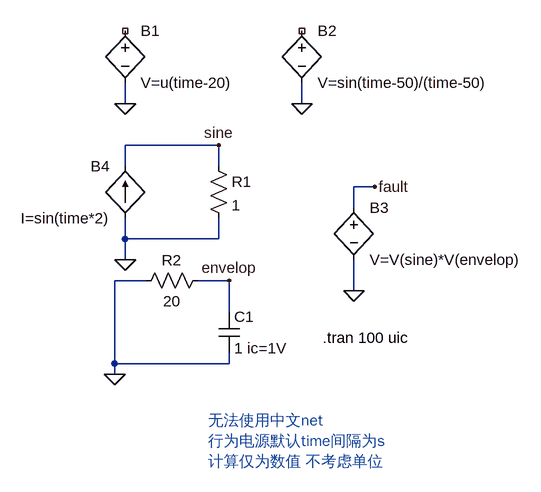
[diagram p0: schematic Draft6.asc]
Draft6.asc, the LTspice schematic file:
Version 4.1
SHEET 1 880 688
WIRE 64 128 64 96
WIRE 336 128 336 96
WIRE 208 192 64 192
WIRE 64 224 64 192
WIRE 208 224 208 192
WIRE 448 256 416 256
WIRE 416 288 416 256
WIRE 64 336 64 304
WIRE 208 336 208 304
WIRE 208 336 64 336
WIRE 64 368 64 336
WIRE 96 400 48 400
WIRE 224 400 176 400
WIRE 416 416 416 368
WIRE 224 448 224 400
WIRE 48 528 48 400
WIRE 224 528 224 512
WIRE 224 528 48 528
WIRE 48 544 48 528
FLAG 64 128 0
FLAG 336 128 0
FLAG 48 544 0
FLAG 416 416 0
FLAG 448 256 fault
FLAG 64 368 0
FLAG 224 400 envelop
FLAG 208 192 sine
SYMBOL bv 64 0 R0
SYMATTR InstName B1
SYMATTR Value V=u(time-20)
SYMBOL bv 336 0 R0
SYMATTR InstName B2
SYMATTR Value V=sin(time-50)/(time-50)
SYMBOL res 192 208 R0
SYMATTR InstName R1
SYMATTR Value 1
SYMBOL res 192 384 R90
WINDOW 0 0 56 VBottom 2
WINDOW 3 32 56 VTop 2
SYMATTR InstName R2
SYMATTR Value 20
SYMBOL cap 208 448 R0
SYMATTR InstName C1
SYMATTR Value 1 ic=1V
SYMBOL bv 416 272 R0
SYMATTR InstName B3
SYMATTR Value V=V(sine)*V(envelop)
SYMBOL bi 64 304 R180
WINDOW 0 24 80 Left 2
WINDOW 3 24 0 Left 2
SYMATTR InstName B4
SYMATTR Value I=sin(time*2)
TEXT 368 488 Left 2 !.tran 100 uic
TEXT 192 616 Left 2 ;无法使用中文net\n行为电源默认time间隔为s\n计算仅为数值 不考虑单位

The netlist it stands for:
* Draft6.asc
B1 NC_01 0 V=u(time-20)
B2 NC_02 0 V=sin(time-50)/(time-50)
R1 sine 0 1
R2 envelop 0 20
C1 envelop 0 1 ic=1V
B3 fault 0 V=V(sine)*V(envelop)
B4 0 sine I=sin(time*2)
.tran 100 uic
* 无法使用中文net
* 行为电源默认time间隔为s
* 计算仅为数值 不考虑单位
.backanno
.end